# Altium project SolarNode.PrjPCB
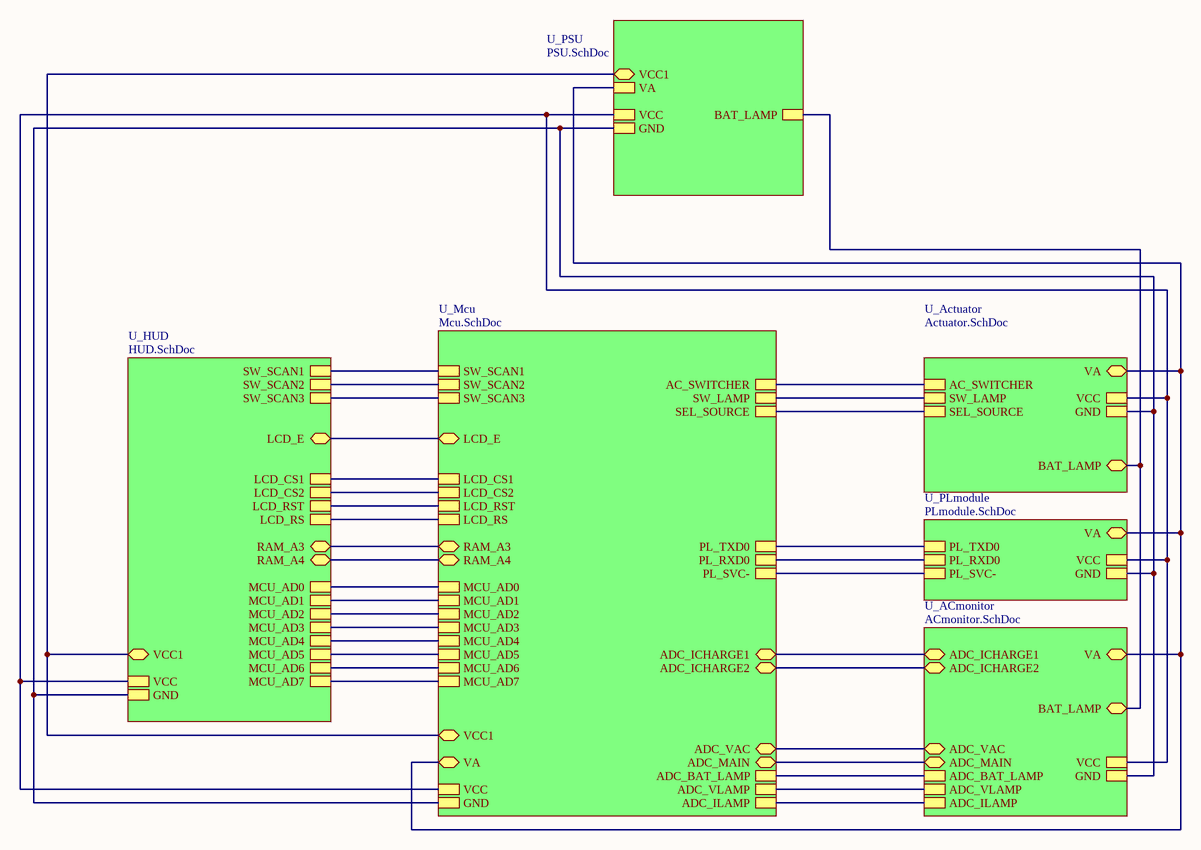
[diagram p0: block.SchDoc]
4 sheets, 115 parts. Net scope: hierarchical (ports join the sheet entries above them; power ports are global).
Board file: SolarNode.PcbDoc
Sheets:
  block.SchDoc
    U_Mcu = Mcu.SchDoc
    U_PSU = PSU.SchDoc
    U_HUD = HUD.SchDoc

## Sheet block.SchDoc
size Letter

### Sub-sheets
U_ACmonitor = ACmonitor.SchDoc (file not in this document): ADC_BAT_LAMP, ADC_VLAMP, ADC_ILAMP, VCC, GND, ADC_VAC, BAT_LAMP, ADC_MAIN, ADC_ICHARGE1, ADC_ICHARGE2, VA
U_Actuator = Actuator.SchDoc (file not in this document): AC_SWITCHER, SW_LAMP, SEL_SOURCE, VCC, GND, BAT_LAMP, VA
U_HUD = HUD.SchDoc: MCU_AD0, MCU_AD1, MCU_AD2, MCU_AD3, MCU_AD4, MCU_AD5, MCU_AD6, MCU_AD7, LCD_CS1, LCD_CS2, LCD_RST, LCD_RS, SW_SCAN1, SW_SCAN2, SW_SCAN3, VCC, GND, LCD_E, RAM_A3, RAM_A4, VCC1
U_Mcu = Mcu.SchDoc: PL_TXD0, PL_RXD0, SW_SCAN1, SW_SCAN2, SW_SCAN3, PL_SVC-, LCD_CS1, LCD_CS2, LCD_RST, LCD_RS, AC_SWITCHER, SW_LAMP, SEL_SOURCE, MCU_AD0, MCU_AD1, MCU_AD2, MCU_AD3, MCU_AD4, MCU_AD5, MCU_AD6, MCU_AD7, VCC, GND, ADC_BAT_LAMP, ADC_VLAMP, ADC_ILAMP, ADC_VAC, LCD_E, ADC_MAIN, VA, ADC_ICHARGE1, ADC_ICHARGE2, RAM_A3, RAM_A4, VCC1
U_PLmodule = PLmodule.SchDoc (file not in this document): PL_SVC-, VCC, GND, PL_TXD0, PL_RXD0, VA
U_PSU = PSU.SchDoc: VCC, GND, BAT_LAMP, VA, VCC1

### Nets
BAT_LAMP: sheet U_Actuator/BAT_LAMP, sheet U_PSU/BAT_LAMP, sheet U_ACmonitor/BAT_LAMP
GND: sheet U_Mcu/GND, sheet U_Actuator/GND, sheet U_PSU/GND, sheet U_HUD/GND, sheet U_PLmodule/GND, sheet U_ACmonitor/GND
VA: sheet U_Mcu/VA, sheet U_Actuator/VA, sheet U_PSU/VA, sheet U_PLmodule/VA, sheet U_ACmonitor/VA
VCC: sheet U_Mcu/VCC, sheet U_Actuator/VCC, sheet U_PSU/VCC, sheet U_HUD/VCC, sheet U_PLmodule/VCC, sheet U_ACmonitor/VCC
VCC1: sheet U_Mcu/VCC1, sheet U_PSU/VCC1, sheet U_HUD/VCC1
AC SWITCHER: sheet U_Mcu/AC_SWITCHER, sheet U_Actuator/AC_SWITCHER
ADC_BAT_LAMP: sheet U_Mcu/ADC_BAT_LAMP, sheet U_ACmonitor/ADC_BAT_LAMP
ADC_ICHARGE1: sheet U_Mcu/ADC_ICHARGE1, sheet U_ACmonitor/ADC_ICHARGE1
ADC_ICHARGE2: sheet U_Mcu/ADC_ICHARGE2, sheet U_ACmonitor/ADC_ICHARGE2
ADC_ILAMP: sheet U_Mcu/ADC_ILAMP, sheet U_ACmonitor/ADC_ILAMP
ADC_MAIN: sheet U_Mcu/ADC_MAIN, sheet U_ACmonitor/ADC_MAIN
ADC_VAC: sheet U_Mcu/ADC_VAC, sheet U_ACmonitor/ADC_VAC
ADC_VLAMP: sheet U_Mcu/ADC_VLAMP, sheet U_ACmonitor/ADC_VLAMP
DB0: sheet U_Mcu/MCU_AD0, sheet U_HUD/MCU_AD0
DB1: sheet U_Mcu/MCU_AD1, sheet U_HUD/MCU_AD1
DB2: sheet U_Mcu/MCU_AD2, sheet U_HUD/MCU_AD2
DB3: sheet U_Mcu/MCU_AD3, sheet U_HUD/MCU_AD3
DB4: sheet U_Mcu/MCU_AD4, sheet U_HUD/MCU_AD4
DB5: sheet U_Mcu/MCU_AD5, sheet U_HUD/MCU_AD5
DB6: sheet U_Mcu/MCU_AD6, sheet U_HUD/MCU_AD6
DB7: sheet U_Mcu/MCU_AD7, sheet U_HUD/MCU_AD7
E: sheet U_Mcu/LCD_E, sheet U_HUD/LCD_E
LCD_CS1: sheet U_Mcu/LCD_CS1, sheet U_HUD/LCD_CS1
LCD_CS2: sheet U_Mcu/LCD_CS2, sheet U_HUD/LCD_CS2
LCD_RS: sheet U_Mcu/LCD_RS, sheet U_HUD/LCD_RS
LCD_RST: sheet U_Mcu/LCD_RST, sheet U_HUD/LCD_RST
PL_SVC-: sheet U_Mcu/PL_SVC-, sheet U_PLmodule/PL_SVC-
RAM_A3: sheet U_Mcu/RAM_A3, sheet U_HUD/RAM_A3
RAM_A4: sheet U_Mcu/RAM_A4, sheet U_HUD/RAM_A4
SEL_SOURCE: sheet U_Mcu/SEL_SOURCE, sheet U_Actuator/SEL_SOURCE
SW_LAMP: sheet U_Mcu/SW_LAMP, sheet U_Actuator/SW_LAMP
SW_SCAN1: sheet U_Mcu/SW_SCAN1, sheet U_HUD/SW_SCAN1
SW_SCAN2: sheet U_Mcu/SW_SCAN2, sheet U_HUD/SW_SCAN2
SW_SCAN3: sheet U_Mcu/SW_SCAN3, sheet U_HUD/SW_SCAN3
NetJ12_2: sheet U_Mcu/PL_RXD0, sheet U_PLmodule/PL_RXD0
NetJ12_4: sheet U_Mcu/PL_TXD0, sheet U_PLmodule/PL_TXD0

## Sheet Mcu.SchDoc
size A2
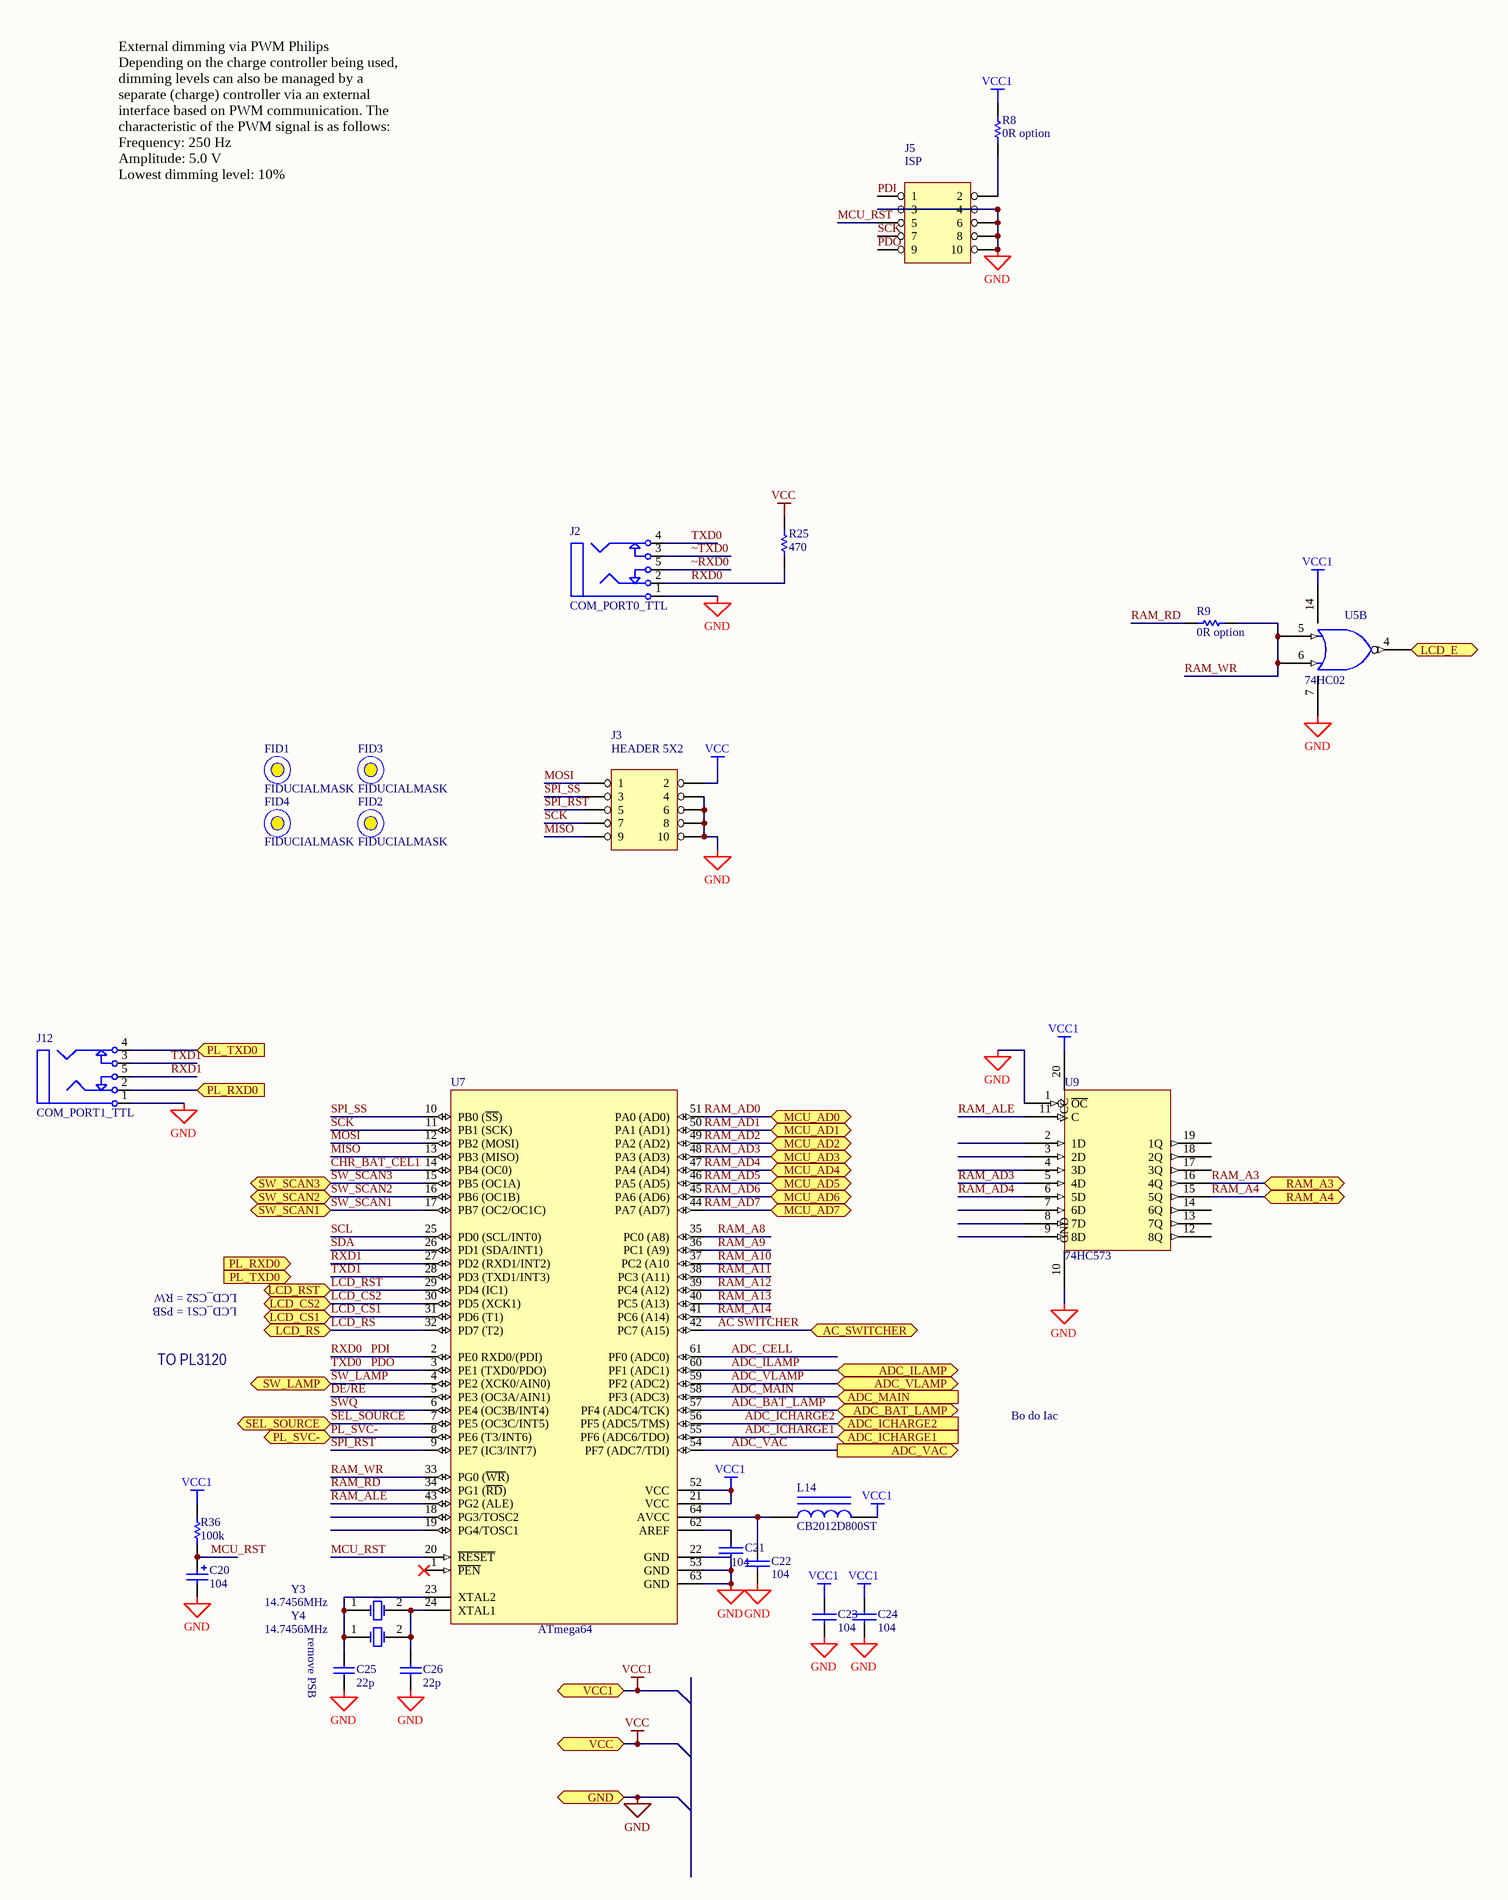
[diagram p1: Mcu.SchDoc, left]
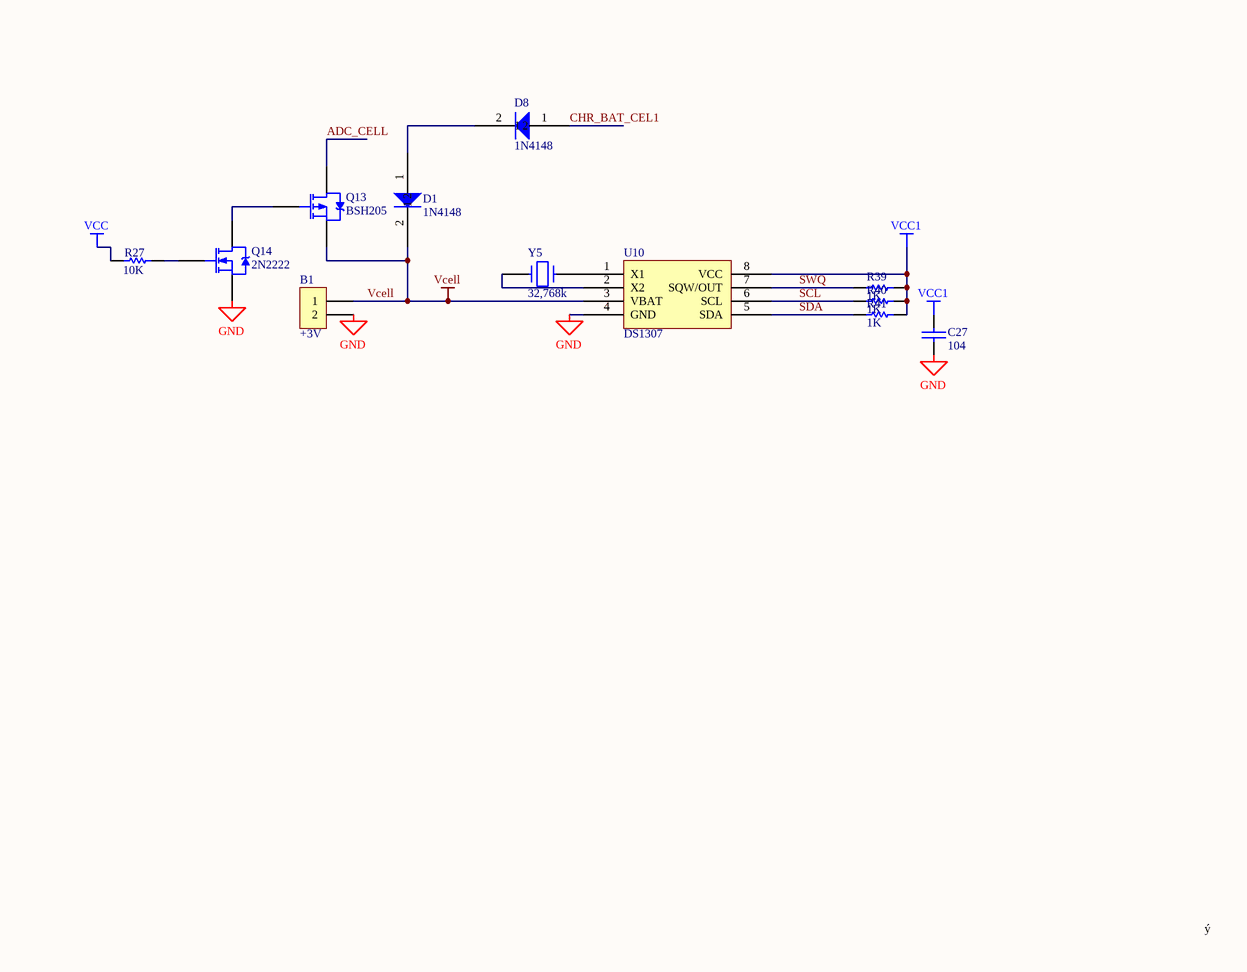
[diagram p2: Mcu.SchDoc, right]

### Parts
B1  +3V  [NI-MH-3V6]
C20  104  [C6-0805_N]
C21  104  [C6-0805_N]
C22  104  [C6-0805_N]
C23  104  [C6-0805_N]
C24  104  [C6-0805_N]
C25  22p  [C6-0805_N]
C26  22p  [C6-0805_N]
C27  104  [C6-0805_N]
D1  1N4148  [SOD80, LL-34]
D8  1N4148  [SOD80, LL-34]
FID1  FIDUCIALMASK  [FIDUCIALMASK]
FID2  FIDUCIALMASK  [FIDUCIALMASK]
FID3  FIDUCIALMASK  [FIDUCIALMASK]
FID4  FIDUCIALMASK  [FIDUCIALMASK]
J2  COM_PORT0_TTL  [SJ-3515]
J3  HEADER 5X2  [10P_PCB_HEADER_BRD_MNT]
J5  ISP  [10P_PCB_HEADER_BRD_MNT]
J12  COM_PORT1_TTL  [SJ-3515]
L14  CB2012D800ST  [R6-0805_N]
Q13  BSH205  [SOT23-3]
Q14  2N2222  [SOT23-3]
R8  0R option  [JP2]
R9  0R option  [6-0805_N]
R25  470  [6-0805_N]
R27  10K  [6-0805_N]
R36  100k  [6-0805_N]
R39  1K  [6-0805_N]
R40  1K  [6-0805_N]
R41  1K  [6-0805_N]
U5  74HC02  [SOIC127P600X175-14AN]  (part B of 4)
U7  ATmega64  [QFP64-3]
U9  74HC573  [SOIC127P1041-20L]
U10  DS1307  [M08A_N]
Y3  14.7456MHz  [XTAL]
Y4  14.7456MHz  [CRYSTAL_HC49-US-SM]
Y5  32,768k  [R38]

### Ports
AC_SWITCHER, ADC_BAT_LAMP, ADC_ICHARGE1, ADC_ICHARGE2, ADC_ILAMP, ADC_MAIN, ADC_VAC, ADC_VLAMP, GND, LCD_CS1, LCD_CS2, LCD_E, LCD_RS, LCD_RST, MCU_AD0, MCU_AD1, MCU_AD2, MCU_AD3, MCU_AD4, MCU_AD5, MCU_AD6, MCU_AD7, PL_RXD0, PL_SVC-, PL_TXD0, RAM_A3, RAM_A4, SEL_SOURCE, SW_LAMP, SW_SCAN1, SW_SCAN2, SW_SCAN3, VCC, VCC1

### Nets
GND: B1.2 C20.2 C21.2 C22.1 C23.2 C24.2 C25.1 C26.1 C27.2 J2.1 J3.4 J3.6 J3.8 J3.10 J5.3 J5.4 J5.6 J5.8 J5.10 J12.1 Q14.2(S) U5.7(GND) U7.22(GND) U7.53(GND) U7.63(GND) U9.1(~{OC}) U9.10(GND) U10.4(GND) ; port GND
VCC: J3.2 R25.1 R27.2 ; port VCC
VCC1: C23.1 C24.1 C27.1 L14.1 R8.1 R36.2 R39.2 R40.2 R41.2 U5.14(VCC) U7.21(VCC) U7.52(VCC) U9.20(VCC) U10.8(VCC) ; port VCC1
Vcell: B1.1 D1.2 Q13.2(S) U10.3(VBAT)
AC SWITCHER: U7.42(PC7_(A15)) ; port AC_SWITCHER
ADC_BAT_LAMP: U7.57(PF4_(ADC4/TCK)) ; port ADC_BAT_LAMP
ADC_CELL: Q13.3(D) U7.61(PF0_(ADC0))
ADC_ICHARGE1: U7.55(PF6_(ADC6/TDO)) ; port ADC_ICHARGE1
ADC_ICHARGE2: U7.56(PF5_(ADC5/TMS)) ; port ADC_ICHARGE2
ADC_ILAMP: U7.60(PF1_(ADC1)) ; port ADC_ILAMP
ADC_MAIN: U7.58(PF3_(ADC3)) ; port ADC_MAIN
ADC_VAC: U7.54(PF7_(ADC7/TDI)) ; port ADC_VAC
ADC_VLAMP: U7.59(PF2_(ADC2)) ; port ADC_VLAMP
CHR_BAT_CEL1: D8.1 U7.14(PB4_(OC0))
DE/RE: U7.5(PE3_(OC3A/AIN1))
E: U5.4 ; port LCD_E
LCD_CS1: U7.31(PD6_(T1)) ; port LCD_CS1
LCD_CS2: U7.30(PD5_(XCK1)) ; port LCD_CS2
LCD_RS: U7.32(PD7_(T2)) ; port LCD_RS
LCD_RST: U7.29(PD4_(IC1)) ; port LCD_RST
MCU_RST: C20.1 J5.5 R36.1 U7.20(~{RESET})
MISO: J3.9 U7.13(PB3_(MISO))
MOSI: J3.1 U7.12(PB2_(MOSI))
PDI: J2.2 J5.1 R25.2 U7.2(PE0_RXD0/(PDI))  [also labelled RXD0]
PDO: J2.4 J5.9 U7.3(PE1_(TXD0/PDO))  [also labelled TXD0]
PL_SVC-: U7.8(PE6_(T3/INT6)) ; port PL_SVC-
RAM_A3: U9.16(4Q) ; port RAM_A3
RAM_A4: U9.15(5Q) ; port RAM_A4
RAM_A8: U7.35(PC0_(A8))
RAM_A9: U7.36(PC1_(A9))
RAM_A10: U7.37(PC2_(A10)
RAM_A11: U7.38(PC3_(A11))
RAM_A12: U7.39(PC4_(A12))
RAM_A13: U7.40(PC5_(A13))
RAM_A14: U7.41(PC6_(A14))
RAM_AD0: U7.51(PA0_(AD0)) ; port MCU_AD0  [project net DB0]
RAM_AD1: U7.50(PA1_(AD1)) ; port MCU_AD1  [project net DB1]
RAM_AD2: U7.49(PA2_(AD2)) ; port MCU_AD2  [project net DB2]
RAM_AD3: U7.48(PA3_(AD3)) U9.5(4D) ; port MCU_AD3  [project net DB3]
RAM_AD4: U7.47(PA4_(AD4)) U9.6(5D) ; port MCU_AD4  [project net DB4]
RAM_AD5: U7.46(PA5_(AD5)) ; port MCU_AD5  [project net DB5]
RAM_AD6: U7.45(PA6_(AD6)) ; port MCU_AD6  [project net DB6]
RAM_AD7: U7.44(PA7_(AD7)) ; port MCU_AD7  [project net DB7]
RAM_ALE: U7.43(PG2_(ALE)) U9.11(C)
RAM_RD: R9.1 U7.34(PG1_(~{RD}))
RAM_WR: R9.2 U5.5 U5.6 U7.33(PG0_(~{WR}))
RXD1: J12.5 U7.27(PD2_(RXD1/INT2))
SCK: J3.7 J5.7 U7.11(PB1_(SCK))
SCL: R40.1 U7.25(PD0_(SCL/INT0)) U10.6(SCL)
SDA: R41.1 U7.26(PD1_(SDA/INT1)) U10.5(SDA)
SEL_SOURCE: U7.7(PE5_(OC3C/INT5)) ; port SEL_SOURCE
SPI_RST: J3.5 U7.9(PE7_(IC3/INT7))
SPI_SS: J3.3 U7.10(PB0_(~{SS}))
SW_LAMP: U7.4(PE2_(XCK0/AIN0)) ; port SW_LAMP
SW_SCAN1: U7.17(PB7_(OC2/OC1C)) ; port SW_SCAN1
SW_SCAN2: U7.16(PB6_(OC1B)) ; port SW_SCAN2
SW_SCAN3: U7.15(PB5_(OC1A)) ; port SW_SCAN3
SWQ: R39.1 U7.6(PE4_(OC3B/INT4)) U10.7(SQW/OUT)
TXD1: J12.3 U7.28(PD3_(TXD1/INT3))
~RXD0: J2.5
~TXD0: J2.3
NetC21_1: C21.1 U7.62(AREF)
NetC22_2: C22.2 L14.2 U7.64(AVCC)
NetC25_2: C25.2 U7.23(XTAL2) Y3.1(OSC1) Y4.1(OSC1)
NetC26_2: C26.2 U7.24(XTAL1) Y3.2(OSC2) Y4.2(OSC2)
NetD1_1: D1.1 D8.2
NetJ5_2: J5.2 R8.2
NetJ12_2: J12.2 ; port PL_RXD0
NetJ12_4: J12.4 ; port PL_TXD0
NetQ13_1: Q13.1(G) Q14.3(D)
NetQ14_1: Q14.1(G) R27.1
NetU10_1: U10.1(X1) Y5.1
NetU10_2: U10.2(X2) Y5.2

Not connected (* = marked no-connect by the designer): J2 1A 1B 2A 2B 3A 3B 4A 4B 5A 5B; J12 1A 1B 2A 2B 3A 3B 4A 4B 5A 5B; U7 1(~{PEN})* 18(PG3/TOSC2) 19(PG4/TOSC1); U9 2(1D) 3(2D) 4(3D) 7(6D) 8(7D) 9(8D) 12(8Q) 13(7Q) 14(6Q) 17(3Q) 18(2Q) 19(1Q)

### Notes on the sheet
- External dimming via PWM Philips
  Depending on the charge controller being used, dimming levels can also be managed by a
  separate (charge) controller via an external interface based on PWM communication. The
  characteristic of the PWM signal is as follows:
  Frequency: 250 Hz
  Amplitude: 5.0 V
  Lowest dimming level: 10%
- LCD_CS1 = PSB
- LCD_CS2 = RW
- TO PL3120
- Bo do Iac
- (near C25) remove PSB
- ý

### Library data of the parts
B1 = CON2: Ni-Mh 3v6 chargable
C20 = Cap Pol1: Polarized Capacitor (Radial); Published: *; LatestRevisionDate: *; LatestRevisionNote: *; PackageReference: *; Publisher: *; Value: *
C21-C24 C27 = CAP: Capacitor
C25 C26 = Cap: Capacitor; Value: 22 pF; Published: 8-Jun-2000; LatestRevisionDate: 17-Jul-2002; LatestRevisionNote: Re-released for DXP Platform.; PackageReference: RAD-0.3; Publisher: Altium Limited
D1 D8 = DIODE: pin to pad: 1>A 2>K
J2 J12 = Phonejack Stereo SW: 3-Conductor Jack with 2 break contacts (normals) and 2 auxiliary make contacts; Published: 5-Jan-2004; LatestRevisionDate: 17-Dec-2003; LatestRevisionNote: PCB Footprint replaced.; DatasheetDocument: 07-Mar-2000; Publisher: Altium Limited; ComponentLink1Description: Manufacturer Link; ComponentLink1URL: http://domino.kycon.com/internet/Products.html
J5 = HEADER 5X2
L14 = INDUCTOR IRON: 80 Ohm SMD-0805 Chip Ferrite Bead
Q13 = PMOS-2: P Mosfet transistor, input Logic level, Fast switching, 12V - 750mA; Note: Pin 4 not drawn and electrically connected to Pin 2.; Published: 8-Jun-2000; LatestRevisionDate: 17-Jul-2002; LatestRevisionNote: Re-released for DXP Platform.; DatasheetVersion: PD-9.390D; PackageVersion: Feb-1997; PackageReference: TO-220AB; Publisher: Altium Limited; PackageDescription: TO, Thru-Hole, Vertical, Heatsink Mounted; 3 In-Line Leads; Pitch 2.54 mm; ComponentLink1Description: Manufacturer Link; ComponentLink1URL: http://www.irf.com/
Q14 = NMOS-2: N-Channel Power MOSFET; Note: Pin 2 is electrically connected to pin 4.; Published: 8-Jun-2000; LatestRevisionDate: 17-Jul-2002; LatestRevisionNote: Re-released for DXP Platform.; DatasheetVersion: PD-9.814; PackageVersion: Feb-1997; PackageReference: TO-220AB; Publisher: Altium Limited; PackageDescription: TO, Thru-Hole, Vertical, Heatsink Mounted; 3 In-Line Leads; Pitch 2.54 mm; ComponentLink1Description: Manufacturer Link; ComponentLink1URL: http://www.irf.com/
R8 R9 = Res Semi: Published: *; LatestRevisionDate: *; LatestRevisionNote: *; PackageReference: *; Publisher: *; Value: *
R25 R27 R36 R39-R41 = Res Semi: Semiconductor Resistor; Published: *; LatestRevisionDate: *; LatestRevisionNote: *; PackageReference: *; Publisher: *; Value: *
U5 = 74LS02
U7 = ATmega64-16AC: 8-Bit AVR Microcontroller with 64K Bytes of In-System Programmable Flash Memory; Published: 17-Sep-2003; LatestRevisionDate: 13-Apr-2006; LatestRevisionNote: IPC-7351 Footprint Added.; DatasheetVersion: 2490C-AVR-009/02; PackageVersion: revB, Oct-2001; PackageReference: 64A; Publisher: Altium Limited; PackageDescription: 64-Pin Thin Quad Flat Pack 0.8 mm Pitch; Code_JEDEC: MS-026-AEB; ComponentLink1Description: Manufacturer Link; ComponentLink1URL: http://www.atmel.com; ComponentLink2Description: Datasheet; ComponentLink2URL: http://www.atmel.com/dyn/resources/prod_documents/doc2490.pdf
Y3 Y4 = XTAL: Crystal Oscillator; Published: 8-Jun-2000; LatestRevisionDate: 17-Jul-2002; LatestRevisionNote: Re-released for DXP Platform.; PackageReference: R38; Publisher: Altium Limited
Y5 = CRYSTAL

## Sheet PSU.SchDoc
size A3
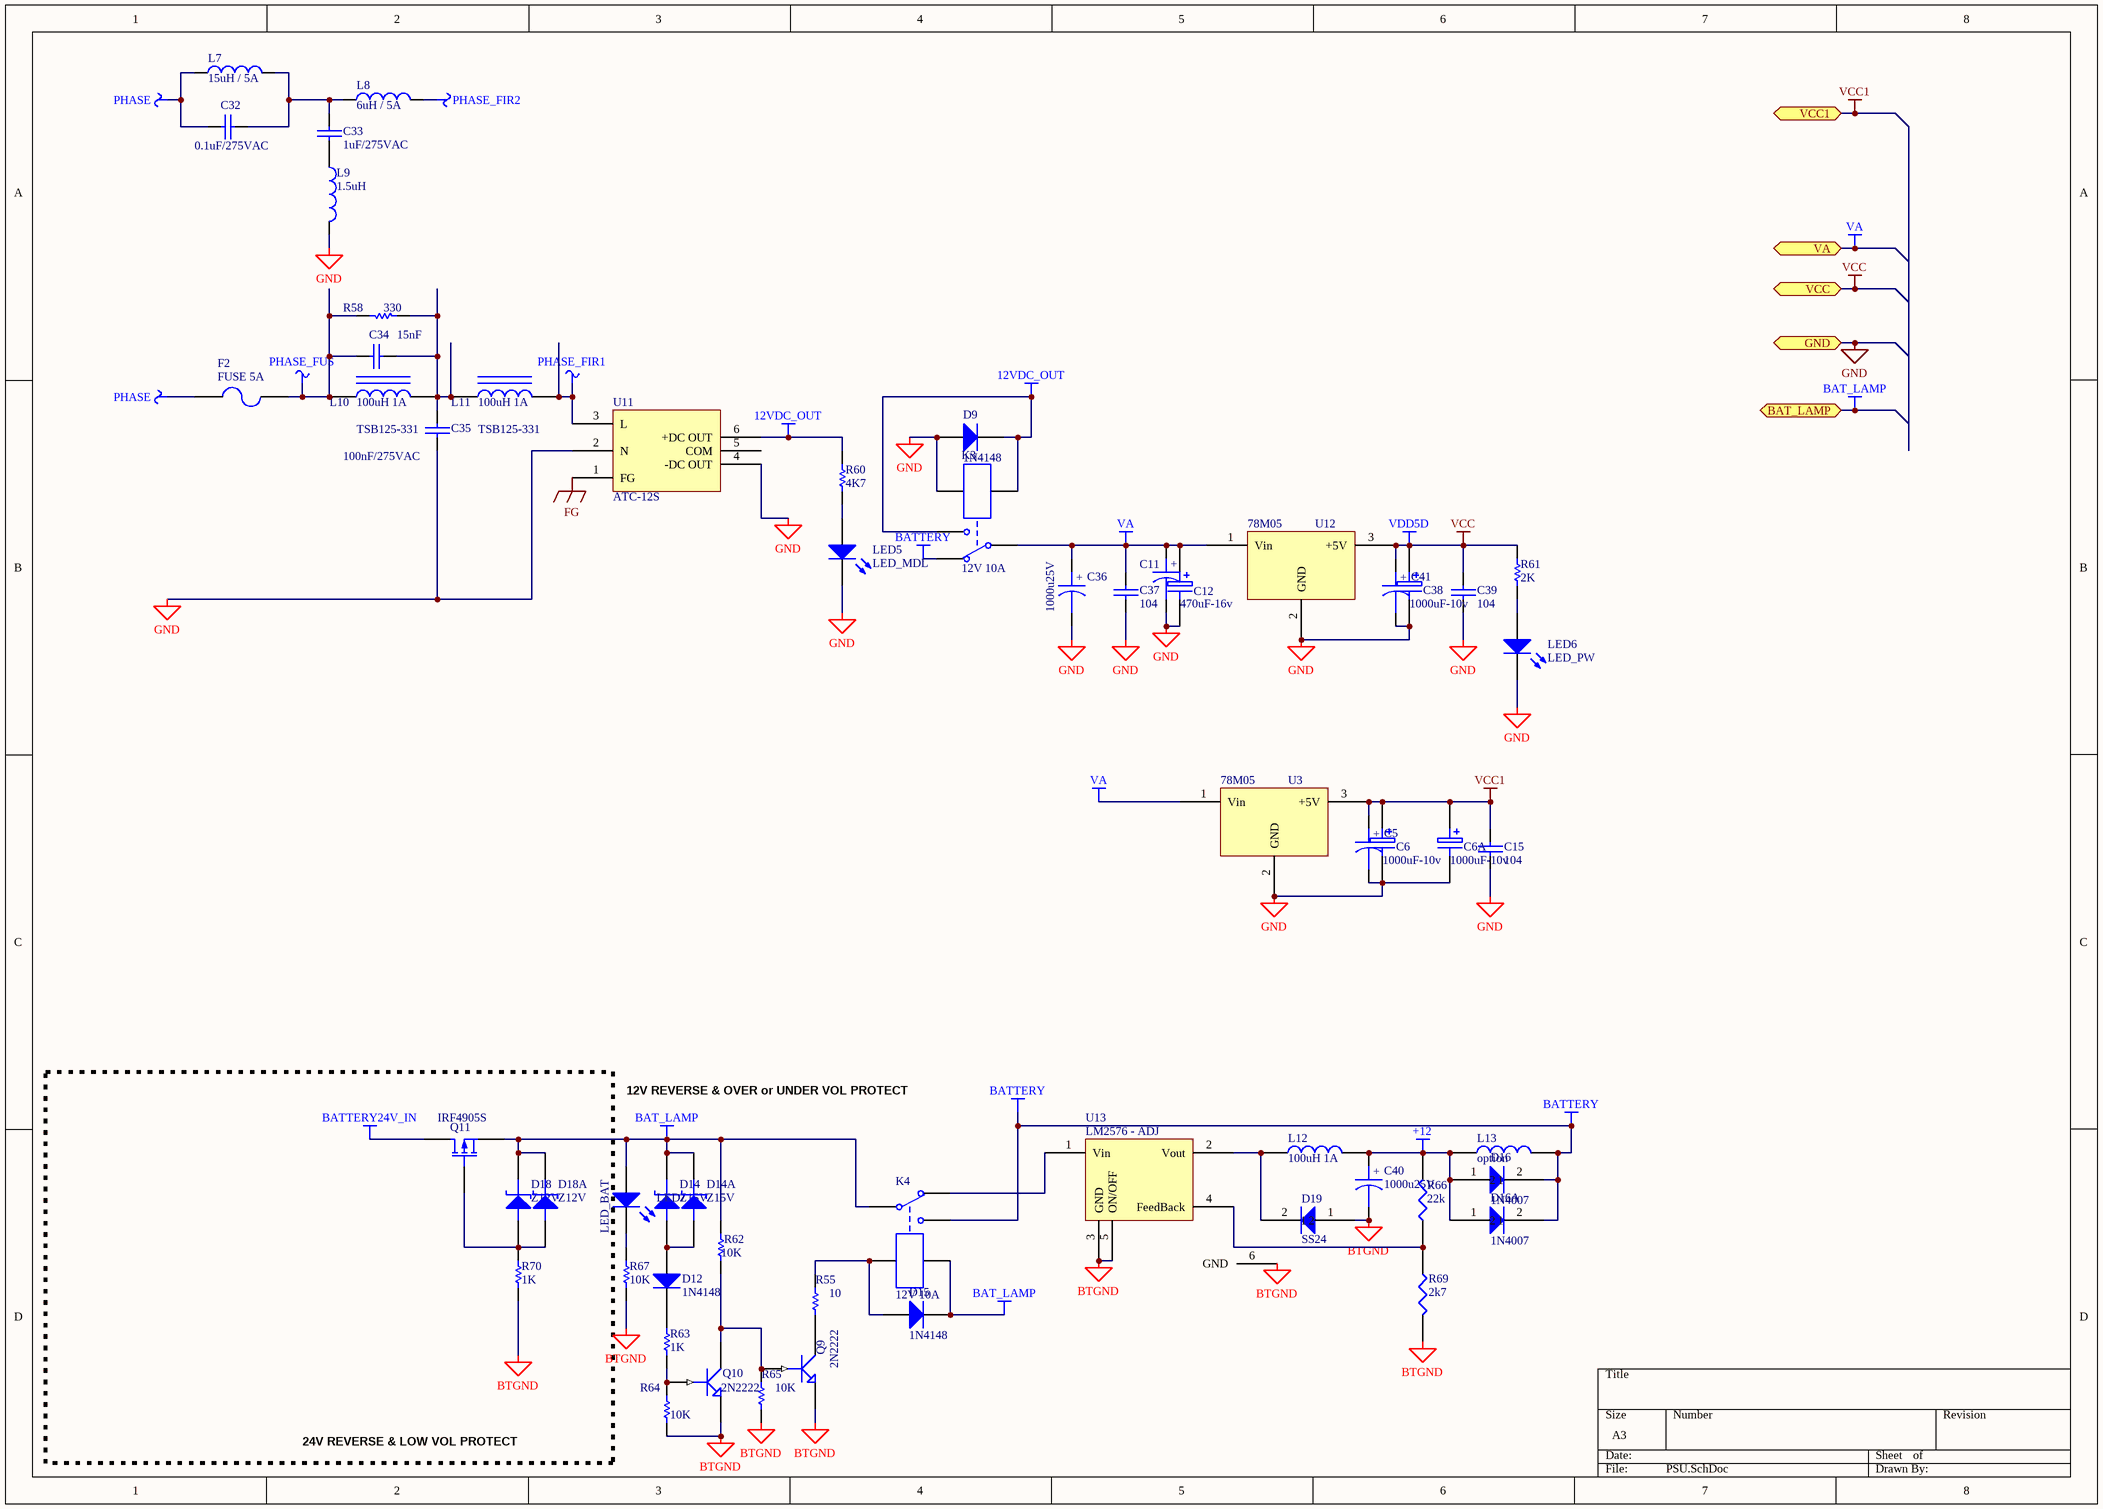
[diagram p3: PSU.SchDoc]

### Parts
C5  1000u25V  [CAP40x20]  (value not drawn)
C6  1000uF-10v  [CAP_ELEC_SIZE_E]
C6A  1000uF-10v  [CAP_ELEC_SIZE_E]
C11  1000u25V  [CAP40x20]  (value not drawn)
C12  470uF-16v  [CAP_ELEC_SIZE_E]
C15  104  [C6-0805_N]
C32  0.1uF/275VAC  [100n400v]
C33  1uF/275VAC  [CAP1.2/0.5]
C34  15nF  [R3216[1206]]
C35  100nF/275VAC  [100n400v]
C36  1000u25V  [CAP40x20]
C37  104  [C6-0805_N]
C38  1000uF-10v  [CAP_ELEC_SIZE_E]
C39  104  [C6-0805_N]
C40  1000u25V  [CAP40x20]
C41  1000u25V  [CAP40x20]  (value not drawn)
D9  1N4148  [SOD80, LL-34]
D12  1N4148  [SOD80, LL-34]
D14  Z15V  [DO-35]
D14A  Z15V  [SOT23-3]
D15  1N4148  [SOD80, LL-34]
D16  1N4007  [DO-214AA]
D16A  1N4007  [DO-214AA]
D18  Z12V  [DO-35]
D18A  Z12V  [SOD80, LL-34]
D19  SS24  [DO-214AA]
F2  FUSE 5A  [FUSE2]
K3  12V 10A  [RELAYVUONG]
K4  12V 10A  [RELAYVUONG]
L7  15uH / 5A  [IND26x8]
L8  6uH / 5A  [IND15X7]
L9  1.5uH  [IND15x7]
L10  100uH 1A  value TSB125-331  [IND1207]
L11  100uH 1A  value TSB125-331  [IND1207]
L12  100uH 1A  [IND1207]
L13  option  [axial-0.3]
LED5  LED_MDL  [LED3mm]
LED6  LED_PW  [LED3mm]
LED7  LED_BAT  [LED3mm]
Q9  2N2222  [SOT23-3]
Q10  2N2222  [SOT23-3]
Q11  IRF4905S  [D2PAK-3]
R55  10  [6-0805_N]
R58  330  [R3216[1206]]
R60  4K7  [6-0805_N]
R61  2K  [6-0805_N]
R62  10K  [6-0805_N]
R63  1K  [6-0805_N]
R64  10K  [6-0805_N]
R65  10K  [6-0805_N]
R66  22k  [6-0805_N]
R67  10K  [6-0805_N]
R69  2k7  [6-0805_N]
R70  1K  [6-0805_N]
U3  78M05  [D2PAK-3]
U11  ATC-12S  [ATC MODULE]
U12  78M05  [D2PAK-3]
U13  LM2576 - ADJ  [TO-263-5]

### Blocks framed on the sheet
24V REVERSE & LOW VOL PROTECT: D18 D18A Q11 R70

### Ports
BAT_LAMP, GND, VA, VCC, VCC1

### Nets
12VDC_OUT: D9.2(K) K3.3 K3.4 R60.2 U11.6(+DC_OUT)
+12: C40.1 D16.1 D16A.1 L12.2 L13.1 R66.2
BAT_LAMP: D14.2(K) D14A.2(K) D15.2(K) D18.2(K) D18A.2(K) K4.1 K4.5 LED7.1(A) Q11.3(S) R62.2 ; port BAT_LAMP
BATTERY: D16.2 D16A.2 K3.2 K4.3 L13.2
BATTERY24V_IN: Q11.2(D)
BTGND: C40.2 D19.1 Q9.2(E) Q10.2(E) R64.1 R65.1 R67.1 R69.2 R70.1 U13.3(GND) U13.5(ON/OFF) U13.6(GND)
FG: U11.1(FG)
GND: C5.2 C6.2 C6A.2 C11.2 C12.2 C15.2 C35.1 C36.2 C37.2 C38.2 C39.2 C41.2 D9.1(A) K3.5 L9.2 LED5.2(K) LED6.2(K) U3.2(GND) U11.2(N) U11.4(-DC_OUT) U12.2(GND) ; port GND
PHASE: C32.2 F2.1 L7.1
PHASE_FIR1: L11.2 U11.3(L)
PHASE_FIR2: L8.2
PHASE_FUS: C34.1 F2.2 L10.1 R58.2
VA: C11.1 C12.1 C36.1 C37.1 K3.1 U3.1(Vin) U12.1(Vin) ; port VA
VCC: C38.1 C39.1 C41.1 R61.2 U12.3(+5V) ; port VCC  [also labelled VDD5D]
VCC1: C5.1 C6.1 C6A.1 C15.1 U3.3(+5V) ; port VCC1
NetC32_1: C32.1 C33.1 L7.2 L8.1
NetC33_2: C33.2 L9.1
NetC34_2: C34.2 C35.2 L10.2 L11.1 R58.1
NetD12_1: D12.1(A) D14.1(A) D14A.1(A)
NetD12_2: D12.2(K) R63.2
NetD15_1: D15.1(A) K4.4 R55.2
NetD18_1: D18.1(A) D18A.1(A) Q11.1(G) R70.2
NetD19_2: D19.2 L12.1 U13.2(Vout)
NetK4_2: K4.2 U13.1(Vin)
NetLED5_1: LED5.1(A) R60.1
NetLED6_1: LED6.1(A) R61.1
NetLED7_2: LED7.2(K) R67.2
NetQ9_1: Q9.1(B) Q10.3(C) R62.1 R65.2
NetQ9_3: Q9.3(C) R55.1
NetQ10_1: Q10.1(B) R63.1 R64.2
NetR66_1: R66.1 R69.1 U13.4(FeedBack)

Not connected (* = marked no-connect by the designer): U11 5(COM)

### Notes on the sheet
- 12V REVERSE & OVER or UNDER VOL PROTECT
- (in symbol CAPACITOR POL) +

### Library data of the parts
C5 C11 C36 C40 C41 = CAPACITOR POL: Capacitor
C6 C6A C12 C38 = ELECTRO1: Electrolytic Capacitor
C15 C34 C37 C39 = CAP: Capacitor
C32 = CAP: 0.1uF/275VAC X2
C33 = CAP: 1uF/275VAC X2
C35 = CAP: 100nF/275VAC X2
D9 D12 D15 = Diode 1N4007: 1 Amp General Purpose Rectifier; pin to pad: 1>A 2>K; Published: 8-Jun-2000; LatestRevisionDate: 17-Jul-2002; LatestRevisionNote: Re-released for DXP Platform.; DatasheetDocument: 1998; PackageDocument: Aug-1999; PackageReference: DO-41; Publisher: Altium Limited; Code_JEDEC: DO-204-AL; ComponentLink1Description: Manufacturer Link; ComponentLink1URL: http://www.fairchildsemi.com/; ComponentLink2Description: Datasheet; ComponentLink2URL: http://www.fairchildsemi.com/ds/1N%2F1N4001.pdf
D14 D18 = ZENER2: Zener Diode
D14A = ZENER2: Zener Diode; pin to pad: 2>3
D16 D16A D19 = DIODE: Hoangphat; pin to pad: 1>A 2>K
D18A = ZENER2: Zener Diode; pin to pad: 1>A 2>K
F2 = FUSE2: Fuse
K3 K4 = Relay-SPDT: G5LA-10A/250VAC / SRC-12VDC-SL-C; Published: 24-Mar-1999; LatestRevisionDate: 17-Jul-2002; LatestRevisionNote: Re-released for DXP Platform.; PackageReference: MODULE5B; Publisher: Altium Limited
L7-L9 = Inductor: Toirodal Inductor; Code_IEC: 1005; Published: 8-Jun-2000; LatestRevisionDate: 29-May-2009; LatestRevisionNote: IPC-7351 Footprint Added.; PackageReference: 0402-A; Publisher: Altium Limited; PackageDescription: Chip Inductor; Code_JEITA: 0402
  L7: Value: 15uH / 5A
  L8: Value: 6uH / 5A
  L9: Value: 1.5uH
L10 L11 = INDUCTOR IRON: 100uH 1A SMD HP
L12 L13 = INDUCTOR
LED5-LED7 = LED3: Typical BLUE SiC LED; Published: 8-Jun-2000; LatestRevisionDate: 17-Dec-2003; LatestRevisionNote: PCB Footprint replaced.; DatasheetVersion: 16-Apr-2002; PackageVersion: 16-Apr-2002; PackageReference: 3.5X2.8X1.9; Publisher: Altium Limited; PackageDescription: SM LED; 2 C-Bend Leads; Body 3.5 x 2.8 x 1.9 mm, inc leads (LxWxH typ)
Q9 Q10 = NPN1: NPN Transistor
Q11 = MOSFET-P: HEXFET Power P MOSFET; pin to pad: 2>4; Published: 8-Jun-2000; LatestRevisionDate: 17-Jul-2002; LatestRevisionNote: Re-released for DXP Platform.; PackageVersion: 1995/1996; PackageReference: E3; Publisher: Altium Limited; PackageDescription: TO, Flat Index; 3 In-Line, Axial Leads; Body Dia. 4.6mm; Lead Dia. 0.5 mm (max)
R55 R60-R65 R67 R70 = Res Semi: Semiconductor Resistor; Published: *; LatestRevisionDate: *; LatestRevisionNote: *; PackageReference: *; Publisher: *; Value: *
R58 = Res Semi: Semiconductor Resistor; Value: 2K2; Published: 8-Jun-2000; LatestRevisionDate: 17-Jul-2002; LatestRevisionNote: Re-released for DXP Platform.; PackageReference: AXIAL-0.5; Publisher: Altium Limited
R66 R69 = RES1
U3 U12 = MC7805T: pin to pad: 2>4
U11 = Component_1
U13 = LM2576

## Sheet HUD.SchDoc
size A4
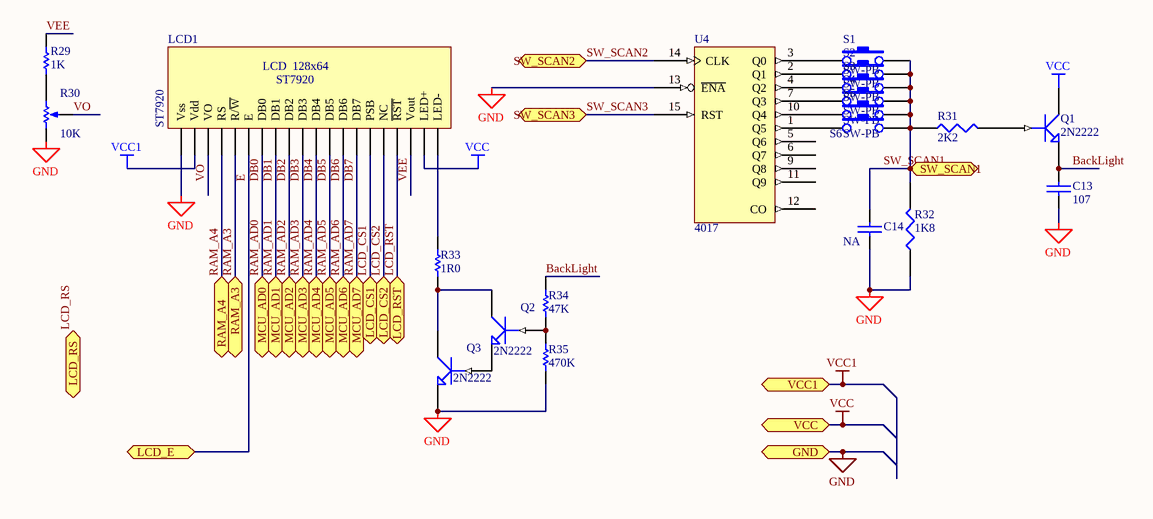
[diagram p4: HUD.SchDoc]

### Parts
C13  107  [CAPMP7343X310N]
C14  NA  [C6-0805_N]
LCD1  ST7920  [LCD12864B]
Q1  2N2222  [SOT23-3]
Q2  2N2222  [SOT23-3]
Q3  2N2222  [SOT23-3]
R29  1K  [6-0805_N]
R30  10K  [BTXANH]
R31  2K2  [6-0805_N]
R32  1K8  [6-0805_N]
R33  1R0  [6-0805_N]
R34  47K  [6-0805_N]
R35  470K  [6-0805_N]
S1  SW-PB  [CTCHIP_TO]
S2  SW-PB  [CTCHIP_TO]
S3  SW-PB  [CTCHIP_TO]
S4  SW-PB  [CTCHIP_TO]
S5  SW-PB  [CTCHIP_TO]
S6  SW-PB  [CTCHIP_TO]
U4  4017  [SOIC127P600X175-16AN]

### Ports
GND, LCD_CS1, LCD_CS2, LCD_E, LCD_RS, LCD_RST, MCU_AD0, MCU_AD1, MCU_AD2, MCU_AD3, MCU_AD4, MCU_AD5, MCU_AD6, MCU_AD7, RAM_A3, RAM_A4, SW_SCAN1, SW_SCAN2, SW_SCAN3, VCC, VCC1

### Nets
GND: C13.2 C14.2 LCD1.1(Vss) Q3.2(E) R30.1(TOP) R32.1 R35.1 U4.8(GND) U4.13(~{ENA}) ; port GND
VCC: LCD1.19(LED+) Q1.3(C) U4.16(VCC) ; port VCC
VCC1: LCD1.2(Vdd) ; port VCC1
BackLight: C13.1 Q1.2(E) R34.2
DB0: LCD1.7(DB0) ; port MCU_AD0  [also labelled RAM_AD0]
DB1: LCD1.8(DB1) ; port MCU_AD1  [also labelled RAM_AD1]
DB2: LCD1.9(DB2) ; port MCU_AD2  [also labelled RAM_AD2]
DB3: LCD1.10(DB3) ; port MCU_AD3  [also labelled RAM_AD3]
DB4: LCD1.11(DB4) ; port MCU_AD4  [also labelled RAM_AD4]
DB5: LCD1.12(DB5) ; port MCU_AD5  [also labelled RAM_AD5]
DB6: LCD1.13(DB6) ; port MCU_AD6  [also labelled RAM_AD6]
DB7: LCD1.14(DB7) ; port MCU_AD7  [also labelled RAM_AD7]
E: LCD1.6(E) ; port LCD_E
LCD_CS1: LCD1.15(PSB) ; port LCD_CS1
LCD_CS2: LCD1.16(NC) ; port LCD_CS2
LCD_RST: LCD1.17(~{RST}) ; port LCD_RST
RAM_A3: LCD1.5(R/~{W}) ; port RAM_A3
RAM_A4: LCD1.4(RS) ; port RAM_A4
SW_SCAN1: C14.1 R31.1 R32.2 S1.2 S2.2 S3.2 S4.2 S5.2 S6.2 ; port SW_SCAN1
SW_SCAN2: U4.14(CLK) ; port SW_SCAN2
SW_SCAN3: U4.15(RST) ; port SW_SCAN3
VEE: LCD1.18(Vout) R29.2
VO: LCD1.3(VO) R30.2(TAP)
NetLCD1_20: LCD1.20(LED-) R33.2
NetQ1_1: Q1.1(B) R31.2
NetQ2_1: Q2.1(B) R34.1 R35.2
NetQ2_2: Q2.2(E) Q3.1(B)
NetQ2_3: Q2.3(C) Q3.3(C) R33.1
NetR29_1: R29.1 R30.3(BOT)
NetS1_1: S1.1 U4.3(Q0)
NetS2_1: S2.1 U4.2(Q1)
NetS3_1: S3.1 U4.4(Q2)
NetS4_1: S4.1 U4.7(Q3)
NetS5_1: S5.1 U4.10(Q4)
NetS6_1: S6.1 U4.1(Q5)

Not connected (* = marked no-connect by the designer): U4 5(Q6) 6(Q7) 9(Q8) 11(Q9) 12(CO)

### Notes on the sheet
- (in symbol ST7920) LCD  128x64

### Library data of the parts
C13 C14 = CAP: Capacitor
LCD1 = ST7920: ST7920 LCD128X64
Q1-Q3 = NPN1: NPN Transistor
R29 = Res Semi: Semiconductor Resistor; Value: 470R; Published: 8-Jun-2000; LatestRevisionDate: 17-Jul-2002; LatestRevisionNote: Re-released for DXP Platform.; PackageReference: AXIAL-0.5; Publisher: Altium Limited
R30 = RPot: Potentiometer; Published: *; LatestRevisionDate: *; LatestRevisionNote: *; PackageReference: *; Publisher: *; Sim Note: *; Set Position: *; Value: *
R31 R32 = RES1
R33 = Res Semi: Semiconductor Resistor; Value: 10R; Published: 8-Jun-2000; LatestRevisionDate: 17-Jul-2002; LatestRevisionNote: Re-released for DXP Platform.; PackageReference: AXIAL-0.5; Publisher: Altium Limited
R34 = Res Semi: Semiconductor Resistor; Value: 2K2; Published: 8-Jun-2000; LatestRevisionDate: 17-Jul-2002; LatestRevisionNote: Re-released for DXP Platform.; PackageReference: AXIAL-0.5; Publisher: Altium Limited
R35 = Res Semi: Semiconductor Resistor; Value: 10K; Published: 8-Jun-2000; LatestRevisionDate: 17-Jul-2002; LatestRevisionNote: Re-released for DXP Platform.; PackageReference: AXIAL-0.5; Publisher: Altium Limited

## Nets that join several sheets
GND: Mcu (28 pins), PSU (21 pins), HUD (9 pins)
VCC: Mcu (J3.2 R25.1 R27.2), PSU (5 pins), HUD (LCD1.19 Q1.3 U4.16)
VCC1: Mcu (14 pins), PSU (5 pins), HUD (LCD1.2)
DB0: Mcu (U7.51), HUD (LCD1.7)
DB1: Mcu (U7.50), HUD (LCD1.8)
DB2: Mcu (U7.49), HUD (LCD1.9)
DB3: Mcu (U7.48 U9.5), HUD (LCD1.10)
DB4: Mcu (U7.47 U9.6), HUD (LCD1.11)
DB5: Mcu (U7.46), HUD (LCD1.12)
DB6: Mcu (U7.45), HUD (LCD1.13)
DB7: Mcu (U7.44), HUD (LCD1.14)
E: Mcu (U5.4), HUD (LCD1.6)
LCD_CS1: Mcu (U7.31), HUD (LCD1.15)
LCD_CS2: Mcu (U7.30), HUD (LCD1.16)
LCD_RST: Mcu (U7.29), HUD (LCD1.17)
RAM_A3: Mcu (U9.16), HUD (LCD1.5)
RAM_A4: Mcu (U9.15), HUD (LCD1.4)
SW_SCAN1: Mcu (U7.17), HUD (9 pins)
SW_SCAN2: Mcu (U7.16), HUD (U4.14)
SW_SCAN3: Mcu (U7.15), HUD (U4.15)